# Altium schematic sheet RelayController.SchDoc
size A4
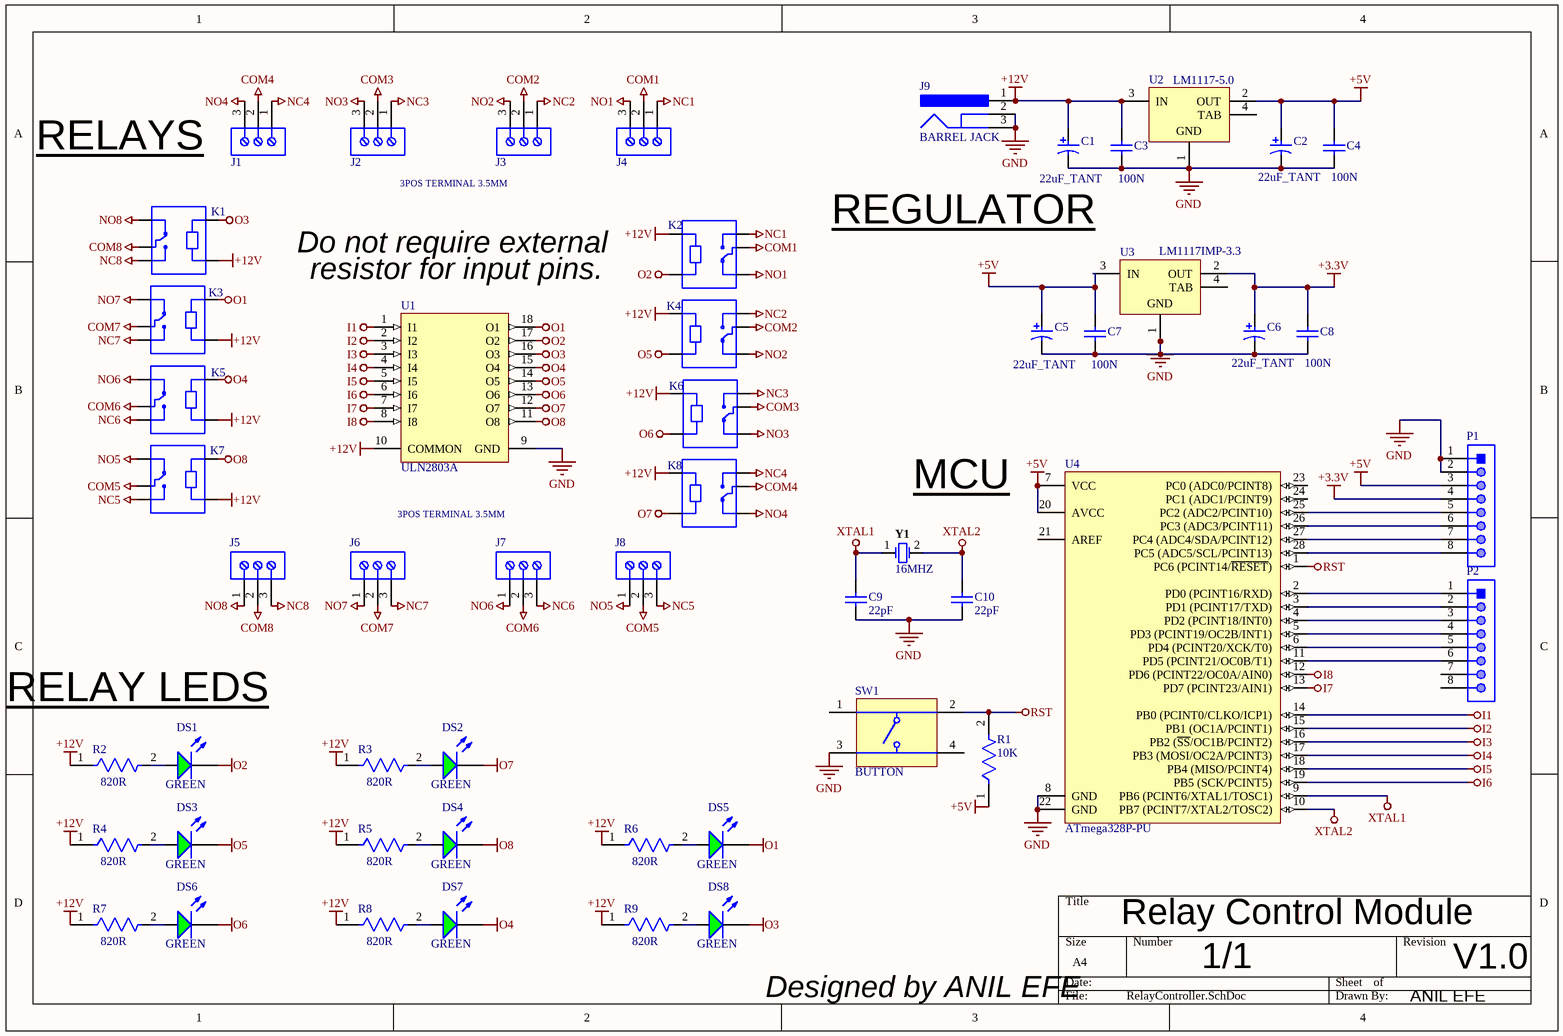
[diagram p0: RelayController.SchDoc]

## Parts
C1  22uF_TANT  [KEMT-T491-D_L]
C2  22uF_TANT  [KEMT-T491-D_L]
C3  100N  [KEMT-1206-2_M]
C4  100N  [KEMT-1206-2_M]
C5  22uF_TANT  [KEMT-T491-D_L]
C6  22uF_TANT  [KEMT-T491-D_L]
C7  100N  [KEMT-1206-2_M]
C8  100N  [KEMT-1206-2_M]
C9  22pF  [KEMT-1206-2_M]
C10  22pF  [KEMT-1206-2_M]
DS1  GREEN  [KING-APTD3216CGCK_V]
DS2  GREEN  [KING-APTD3216CGCK_V]
DS3  GREEN  [KING-APTD3216CGCK_V]
DS4  GREEN  [KING-APTD3216CGCK_V]
DS5  GREEN  [KING-APTD3216CGCK_V]
DS6  GREEN  [KING-APTD3216CGCK_V]
DS7  GREEN  [KING-APTD3216CGCK_V]
DS8  GREEN  [KING-APTD3216CGCK_V]
J1  691214110003  [691214110003]  (value not drawn)
J2  691214110003  [691214110003]  (value not drawn)
J3  3POS TERMINAL 3.5MM  [691214110003]
J4  691214110003  [691214110003]  (value not drawn)
J5  691214110003  [691214110003]  (value not drawn)
J6  3POS TERMINAL 3.5MM  [691214110003]
J7  691214110003  [691214110003]  (value not drawn)
J8  691214110003  [691214110003]  (value not drawn)
J9  BARREL JACK  [CUI-PJ-002AH-4_V]
K1  SRD-05VDC-SL-C  [RELAY_SRD-05VDC-SL-C]  (value not drawn)
K2  SRD-05VDC-SL-C  [RELAY_SRD-05VDC-SL-C]  (value not drawn)
K3  SRD-05VDC-SL-C  [RELAY_SRD-05VDC-SL-C]  (value not drawn)
K4  (no value)  [RELAY_SRD-05VDC-SL-C]
K5  SRD-05VDC-SL-C  [RELAY_SRD-05VDC-SL-C]  (value not drawn)
K6  SRD-05VDC-SL-C  [RELAY_SRD-05VDC-SL-C]  (value not drawn)
K7  SRD-05VDC-SL-C  [RELAY_SRD-05VDC-SL-C]  (value not drawn)
K8  SRD-05VDC-SL-C  [RELAY_SRD-05VDC-SL-C]  (value not drawn)
P1  66200811122  [66200811122]  (value not drawn)
P2  66200811122  [66200811122]  (value not drawn)
R1  10K  [FP-RC1206-MFG]
R2  820R  [FP-RC1206-MFG]
R3  820R  [FP-RC1206-MFG]
R4  820R  [FP-RC1206-MFG]
R5  820R  [FP-RC1206-MFG]
R6  820R  [FP-RC1206-MFG]
R7  820R  [FP-RC1206-MFG]
R8  820R  [FP-RC1206-MFG]
R9  820R  [FP-RC1206-MFG]
SW1  BUTTON  [TECO-FSM4JSMATR_V]
U1  ULN2803A  [STM-DIP-18]
U2  LM1117-5.0  [DCY0004A_M]
U3  LM1117IMP-3.3  [DCY0004A_N]
U4  ATmega328P-PU  [28P3]
Y1  16MHZ  [FOX-FOXSLF-2_V]

## Nets
+3.3V: C6.1 C8.2 P1.4 U3.2(OUT)
+5V: C2.1 C4.2 C5.1 C7.2 P1.3 R1.1 U2.2(OUT) U3.3(IN) U4.7(VCC) U4.20(AVCC)
+12V: C1.1 C3.2 J9.1 K1.A1 K2.A1 K3.A1 K4.A1 K5.A1 K6.A1 K7.A1 K8.A1 R2.1 R3.1 R4.1 R5.1 R6.1 R7.1 R8.1 R9.1 U1.10(COMMON) U2.3(IN)
COM1: J4.2 K2.COM
COM2: J3.2 K4.COM
COM3: J2.2 K6.COM
COM4: J1.2 K8.COM
COM5: J8.2 K7.COM
COM6: J7.2 K5.COM
COM7: J6.2 K3.COM
COM8: J5.2 K1.COM
GND: C1.2 C2.2 C3.1 C4.1 C5.2 C6.2 C7.1 C8.1 C9.1 C10.1 J9.2 J9.3 P1.1 P1.2 SW1.3 U1.9(GND) U2.1(GND) U3.1(GND) U4.8(GND) U4.22(GND)
I1: U1.1(I1) U4.14(PB0_(PCINT0/CLKO/ICP1))
I2: U1.2(I2) U4.15(PB1_(OC1A/PCINT1))
I3: U1.3(I3) U4.16(PB2_(~{SS}/OC1B/PCINT2))
I4: U1.4(I4) U4.17(PB3_(MOSI/OC2A/PCINT3))
I5: U1.5(I5) U4.18(PB4_(MISO/PCINT4))
I6: U1.6(I6) U4.19(PB5_(SCK/PCINT5))
I7: U1.7(I7) U4.13(PD7_(PCINT23/AIN1))
I8: U1.8(I8) U4.12(PD6_(PCINT22/OC0A/AIN0))
NC1: J4.1 K2.NO
NC2: J3.1 K4.NO
NC3: J2.1 K6.NO
NC4: J1.1 K8.NO
NC5: J8.3 K7.NO
NC6: J7.3 K5.NO
NC7: J6.3 K3.NO
NC8: J5.3 K1.NO
NO1: J4.3 K2.NC
NO2: J3.3 K4.NC
NO3: J2.3 K6.NC
NO4: J1.3 K8.NC
NO5: J8.1 K7.NC
NO6: J7.1 K5.NC
NO7: J6.1 K3.NC
NO8: J5.1 K1.NC
O1: DS5.2(K) K3.A2 U1.18(O1)
O2: DS1.2(K) K2.A2 U1.17(O2)
O3: DS8.2(K) K1.A2 U1.16(O3)
O4: DS7.2(K) K5.A2 U1.15(O4)
O5: DS3.2(K) K4.A2 U1.14(O5)
O6: DS6.2(K) K6.A2 U1.13(O6)
O7: DS2.2(K) K8.A2 U1.12(O7)
O8: DS4.2(K) K7.A2 U1.11(O8)
RST: R1.2 SW1.2 U4.1(PC6_(PCINT14/~{RESET}))
XTAL1: C9.2 U4.9(PB6_(PCINT6/XTAL1/TOSC1)) Y1.1
XTAL2: C10.2 U4.10(PB7_(PCINT7/XTAL2/TOSC2)) Y1.2
NetDS1_1: DS1.1(A) R2.2
NetDS2_1: DS2.1(A) R3.2
NetDS3_1: DS3.1(A) R4.2
NetDS4_1: DS4.1(A) R5.2
NetDS5_1: DS5.1(A) R6.2
NetDS6_1: DS6.1(A) R7.2
NetDS7_1: DS7.1(A) R8.2
NetDS8_1: DS8.1(A) R9.2
NetP1_5: P1.5 U4.25(PC2_(ADC2/PCINT10))
NetP1_6: P1.6 U4.26(PC3_(ADC3/PCINT11))
NetP1_7: P1.7 U4.27(PC4_(ADC4/SDA/PCINT12))
NetP1_8: P1.8 U4.28(PC5_(ADC5/SCL/PCINT13))
NetP2_1: P2.1 U4.2(PD0_(PCINT16/RXD))
NetP2_2: P2.2 U4.3(PD1_(PCINT17/TXD))
NetP2_3: P2.3 U4.4(PD2_(PCINT18/INT0))
NetP2_4: P2.4 U4.5(PD3_(PCINT19/OC2B/INT1))
NetP2_5: P2.5 U4.6(PD4_(PCINT20/XCK/T0))
NetP2_6: P2.6 U4.11(PD5_(PCINT21/OC0B/T1))

Not connected (* = marked no-connect by the designer): P2 7 8; SW1 1 4; U2 4(TAB); U3 4(TAB); U4 21(AREF) 23(PC0_(ADC0/PCINT8)) 24(PC1_(ADC1/PCINT9))

## Notes on the sheet
- RELAYS
- (near C1) REGULATOR
- Do not require external
- resistor for input pins.
- MCU
- RELAY LEDS
- Relay Control Module
- 1/1
- V1.0
- Designed by ANIL EFE
- ANIL EFE

## Library data of the parts
C1 C2 C5 C6 = CMP-2000-07201-1: Tantalum Surface Mount Capacitor, 22 uF, +/- 10%, 16 V, -55 to 125 degC, 2-Pin SMD, RoHS, Tape and Reel; Manufacturer: Kemet; Voltage Rating: 16V; ESR: 0.8ohm; Capacitance: 22µF; SVHC: –; Capacitor Case Style: 2917; Package Description: 2-Pin Surface Mount Device, Body 7.3 x 4.3 mm; Mounting Technology: SurfaceMount; Datasheet URL: http://www.kemet.com/Lists/ProductCatalog/Attachments/254/KEM_T2005_T491.pdf; Lead Spacing: –; Capacitor Terminals: SMD; Datasheet Version: 06/2016; Package Reference: T491-D; Manufacturer URL: http://www.kemet.com/; Capacitance Tolerance: ±10%; MSL: MSL1-Unlimited; Operating Temperature Range: -55°Cto+125°C
C3 C4 C7-C10 = CMP-2000-05169-1: CAP, Ceramic, 0.1 uF, +/- 10%, 50 V, -55 to 125 degC, 1206 (3216 Metric), RoHS, Tape and Reel; Manufacturer: Kemet; Voltage Rating: 50V; Capacitance: 0.1µF; Product Range: KEMET-CSeries; SVHC: ToBeAdvised; Dielectric Characteristic: X7R; Capacitor Case Style: 1206[3216Metric]; Package Reference: 1206-2; Package Description: 2-Leads SMD, Body 3.2 x 1.6 mm; Packaging: Tape&Reel; Operating Temperature Max: 125degC; Capacitance Tolerance: ±10%; Datasheet URL: https://datasheet.ciiva.com/6125/1725438-6125494.pdf; Manufacturer URL: http://www.kemet.com/; Operating Temperature Min: -55degC; Datasheet Version: Jul-13
DS1-DS8 = CMP-2000-05792-1: Chip LED Lamp, Green, 5 V, 30 mA, -40 to 85 degC, 2-Pin SMD, RoHS, Tape and Reel; Manufacturer: Kingbright; Wavelength - Dominant: 570nm; Online Catalog: 3.2mmx1.6mmRoundwithDomedTop1206PackageLEDs; Viewing Angle: 50°; Voltage - Forward (Vf) (Typ): 2.1V; Lens Type: Clear; Wavelength - Peak: 574nm; Other Names: 754-1152-2; 3D Model: APTD3216x.sldprt / APTD3216x.pro / APTD3216x.igs / APTD3216x.stp; Catalog Drawings: APTD3216SeriesTop / APTD3216SeriesSide; Current - Test: 20mA; Millicandela Rating: 300mcd; Lens Style/Size: RoundwithDomedTop,1.6mm; Standard Package: 2,000; Datasheet URL: https://www.kingbrightusa.com/images/catalog/spec/APTD3216CGCK.pdf; Family: LEDIndication-Discrete; Category: Optoelectronics; Package Reference: APTD3216CGCK; Datasheet Version: Rev. V.17B, 04/2015; Package / Case: 1206(3216Metric); Mounting Technology: SurfaceMount; Color: Green; Packaging: Tape&Reel(TR); Manufacturer URL: http://www.kingbright.com/; Height: 1.80mm; Package Description: 2-Pin Surface Mount Device, Body 3.2 x 1.6 mm; Mounting Type: SurfaceMount; Size / Dimension: 3.20mmLx1.60mmW
J1-J8 = CMP-1502-02466-1: Serie 2141 - 3.50 mm Horizontal Entry Modular with Rising Cage Clamp WR-TBL, 3 pin; Manufacturer: Wurth Elektronik; Pin Number: 3; Pitch: 3.50mm; Package Reference: 691214110003; Mounting Technology: THT; Part Number: 691214110003; Manufacturer URL: http://www.we-online.de; Packaging: Box; Operating Temperature: -40to105degC; Publisher: WurthElektronik; Datasheet URL: http://katalog.we-online.de/em/datasheet/6912141100xx.pdf
J9 = CMP-2000-06896-1: DC Power Jack, Right Angle, -25 to 85 degC, 4-Pin 14.8 x 9 x 11 mm SMD, RoHS, Tape and Reel; Manufacturer: CUIInc.; PartNumber: PJ-002AH; Current Rating: 5A; Voltage Rating: 24V; Outside Contact Diameter: 6.5mm; Inside Contact Diameter: 2mm; Insulation Resistance: 100MOhms; Brand: CUI; Contact Plating: Nickel; Contact Gender: Male; Datasheet URL: http://www.cui.com/product/resource/pj-002ah-smt.pdf; Mounting Style: SMD/SMT; Mounting Technology: SurfaceMount; Operating Temperature Range: -25Cto+85C; Flammability Rating: UL94V-0; Mounting Angle: Right; Packaging: Reel; Connector Type: DCPowerJack; Product Category: DCPowerConnectors; Package Description: 4-Pin Surface Mount Device, Body 14.8 x 9 mm, Pitch 6.1 mm; Factory Pack Quantity: 350; Datasheet Version: Rev. 1.03, 11/2012; Contact Material: Brass; Package Reference: PJ-002AH; Housing Material: Polyamide(PA); Manufacturer URL: http://www.cui.com/; Product: Jacks; RoHS: True; Termination Style: SMD/SMT
K1-K8 = SRD-05VDC-SL-C: 5V Trigger Relay Module For Arduino And Raspberry Pi 5V Trigger Relay Module For Arduino And Raspberry Pi; MF: Songle Relay; Package: None; Availability: Unavailable; Value: *; MP: SRD-05VDC-SL-C; SnapEDA_Link: https://www.snapeda.com/parts/SRD-05VDC-SL-C/Songle%20Relay/view-part/1029484/?ref=snap; Price: None
P1 P2 = CMP-1502-00446-1: THT Male Header WR-MPC3, Vertical, Single Row, pitch 3 mm, 8 pins; Manufacturer: Wurth Elektronik; Pitch: 3mm; Working Voltage: 250VAC; Contact Resistance: 10mOhm; Pin Number: 8; Orientation: Vertical; Operating Temperature: -40to105degC; Gender: Male; Mounting Technology: THT; Datasheet URL: https://katalog.we-online.de/em/datasheet/6620xx11122.pdf; Publisher: WurthElektronik; Package Reference: 66200811122; Part Number: 66200811122; Manufacturer URL: http://www.we-online.de; Packaging: Tube
R1-R9 = CMP-03412-007570-1: RES SMD 0 OHM JUMPER 1/4W 1206; Manufacturer Part Number: RC1206JR-070RL; Manufacturer: YAGEO; Voltage Rating: 200V; Temperature Coefficient: 300ppm/°C; Power Rating: 0.25W; Value: 0Ω; Description: 0 Ohms Jumper 0.25W, 1/4W Chip Resistor 1206 (3216 Metric) Moisture Resistant Thick Film; Tolerance: 5%; Temperature Range Low: -55°C; Category: Res; Automotive: No; Ipc Land Pattern Name: RESC310160X55; Device Class L1: Passive Components; Temperature: -55°C to +155°C; ComponentLink2URL: https://www.yageo.com/upload/media/product/productsearch/datasheet/rchip/PYu-RC_Group_51_RoHS_L_10.pdf; Lead Free: Yes; Height: 0.65mm; Footprint Url: https://www.yageo.com/upload/website/yageo_PYu-R_Mount_10_19050818_343.pdf; Package: RC1206; Digikey Description: RES SMD 0 OHM JUMPER 1/4W 1206; Temperature Range High: +155°C; Device Class L3: Chip SMD Resistors; Device Class L2: Resistors; Octopart: https://octopart.com/rc1206jr-070rl-yageo-40025601; Resistance: 0Ω; Series: RC; ComponentLink2Description: Datasheet; Composition: Thick Film; RoHS: TRUE; Mouser Description: Resistor: thick film; SMD; 1206; 0O; 0.25W; ±5%; -55÷155°C
SW1 = CMP-2000-07486-1: Micro Miniature Push Button Switch FSM JSM, 50 mA, -35 to 85 degC, 4-Pin SMD, RoHS, Tape and Reel; Manufacturer: TE Connectivity; Mechanical Life: 100000Cycles; Current Rating: 50mA; Actuator Material: Polyamide; Max Voltage Rating (DC): 12V; Capacitance: 0f; Illumination Type: Illuminated; Voltage Rating (DC): 24V; Case\/Package: SMD/SMT; Operating Force: 160gf; Contact Resistance: 100mOhm; Actuator Length: 0.055inch; Switch Travel: 0.25mm; Throw Configuration: SPST; Termination: GullWing; Contact Plating: Silver; Orientation: Straight; Mounting Technology: SurfaceMount; REACH SVHC: Unknown; Electrical Life: 100000Cycles; Package Reference: FSM4JSMATR; Max Operating Temperature: 85degC; Manufacturer URL: http://www.te.com/; Package Description: 4-Pin Surface Mount Device, Body 6 x 6 mm, Pitch 4.5 mm; Datasheet Version: Rev. V, 02/2015; Packaging: TapeandReel; Min Operating Temperature: -35degC; Mount: SurfaceMount; Contact Current Rating: 50mA; Contact Material: CopperAlloy; Package Quantity: 1200; Datasheet URL: http://www.te.com/commerce/DocumentDelivery/DDEController?Action=showdoc&DocId=Customer+Drawing%7F2-1437565-7%7FV%7Fpdf%7FEnglish%7FENG_CD_2-1437565-7_V.pdf%7F4-1437565-2; RoHSCompliant: true
U1 = CMP-2000-05363-1: Eight Darlington Arrays, 50 V, 2.25 W, 500 mA, 18-Pin DIP, RoHS, Tube; Manufacturer: STMicroelectronics; DC Collector Current: 500mA; DC Current Gain hFE: 1000hFE; SVHC: NoSVHC(17-Dec-2015); Power Dissipation Pd: 2.25W; Transistor Polarity: NPN; Collector Emitter Voltage V(br)ceo: 50V; No. of Pins: 18Pins; Automotive Qualification Standard: -; Package Reference: DIP-18; Manufacturer URL: http://www.st.com/; MSL: -; Operating Temperature Max: 85degC; Datasheet Version: Sep-03; Transistor Case Style: DIP; Package Description: 18-Pin Double In-line Package, Body 24.8 x 7.1 mm, Pitch 2.54 mm; Product Range: -; Datasheet URL: https://datasheet.ciiva.com/29306/171824-da-01-en-ic-uln2803-dil18-29306026.pdf
U2 = CMP-0062-01627-4: 800mA Low-Dropout Linear Regulator, 4-pin SOT-223, Pb-Free; Manufacturer: Texas Instruments; PartNumber: LM1117IMP-5.0/NOPB; PackageTopMarking: XYTT*N06B; CompType: LDO IC; PowerWise: N; High-Reliability: Y; RoHS: Y; Code_JEDEC: TO-261-AA; ComponentLink1URL: http://www.ti.com/general/docs/lit/getliterature.tsp?genericPartNumber=LM1117-N&fileType=pdf; Code_IPC: SOT223-4; ComponentLink1Description: Datasheet URL; PackageReference: DCY0004A; PinCount: 4; PackageDescription: Molded SOT-223, 6.50 x 3.56 x 1.6mm Body, 4 Lead, 2.3mm Pitch
U3 = CMP-0062-01631-4: 800mA Low-Dropout Linear Regulator, 4-pin SOT-223, Pb-Free; PartNumber: LM1117IMP-3.3/NOPB; Manufacturer: Texas Instruments; PackageTopMarking: XYTT*N05B; PowerWise: N; High-Reliability: Y; CompType: LDO IC; Code_IPC: SOT223-4; PackageReference: DCY0004A; PinCount: 4; PackageDescription: Molded SOT-223, 6.50 x 3.56 x 1.6mm Body, 4 Lead, 2.3mm Pitch; RoHS: Y; ComponentLink1Description: Datasheet URL; Code_JEDEC: TO-261-AA; ComponentLink1URL: http://www.ti.com/general/docs/lit/getliterature.tsp?genericPartNumber=LM1117-N&fileType=pdf
U4 = CMP-0095-00013-2: 8-bit AVR Microcontroller, 32KB Flash, 1KB EEPROM, 2KB SRAM, 28-pin PDIP, Industrial Grade (-40°C to 85°C); RevisionNote: DatasheetVersion updated. URLs added.; PackageVersion: revB, Sep-2001; PackageDescription: 28-lead (0.300"/7.62mm Wide) Plastic Dual Inline Package (PDIP); DatasheetVersion: revD, May-2011; ComponentLink1Description: Manufacturer URL; ComponentLink1URL: http://www.atmel.com/; PackageReference: 28P3; ComponentLink2Description: ATmega48A/48PA/88A/88PA/168A/168PA/328/328P Datasheet; ComponentLink3URL: http://www.atmel.com/dyn/resources/prod_documents/8271S.pdf; ComponentLink2URL: http://www.atmel.com/dyn/resources/prod_documents/8271.pdf; ComponentLink3Description: ATmega48A/48PA/88A/88PA/168A/168PA/328/328P Summary
Y1 = CMP-1749-00004-1: Resistance Weld Thru-Hole Crystal, 12 MHz, +/-30 ppm, -20 to 70 degC, 2-Pin THD, RoHS, Bulk; Elements: 1; Rds On Max: 115 mohm; Typical Rise Time: 90 ns; Max Power Dissipation: 2.5 W; Case\Package: TO-251-3; Input Capacitance: 350 pF; REACH SVHC: No SVHC; Length: 6.6 mm; ComponentLink1URL: http://www.foxonline.com/; PackageDescription: 2-Pin Through Hole Device, Body 11.35 x 4.65 mm, Pitch 4.88 mm; Radiation Hardening: No; Package Quantity: 70; Packaging: Rail/Tube; ComponentLink1Description: Manufacturer URL; Min Operating Temperature: -55 degC; Max Operating Temperature: 150 degC; RoHSCompliant: true; PackageReference: FOXSLF-2; DatasheetVersion: Mar-15; Pins: 3; Height: 6.1 mm; Mount: Through Hole; ComponentLink2URL: http://www.foxonline.com/pdfs/hc49slf.pdf; ComponentLink2Description: Datasheet; Width: 2.3 mm